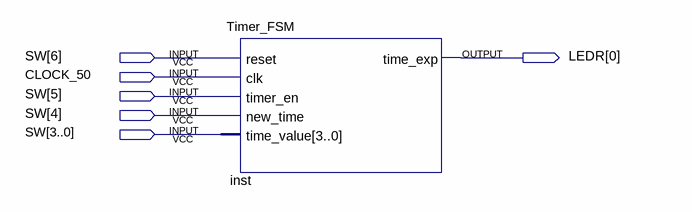
[diagram p0: schematic sheet]
// Quartus schematic TimerDemo.bdf as structural Verilog: 1 symbols, 6 pins
module TimerDemo (
  input  [6:0] SW,
  input  CLOCK_50,
  output [0:0] LEDR
);

  Timer_FSM inst (
    .reset(SW[6]), .clk(CLOCK_50), .timer_en(SW[5]), .new_time(SW[4]), .time_value(SW[3:0]),
    .time_exp(LEDR[0]));
endmodule
